# Altium project Reconfigurable_Test_Fixture.PrjPcb
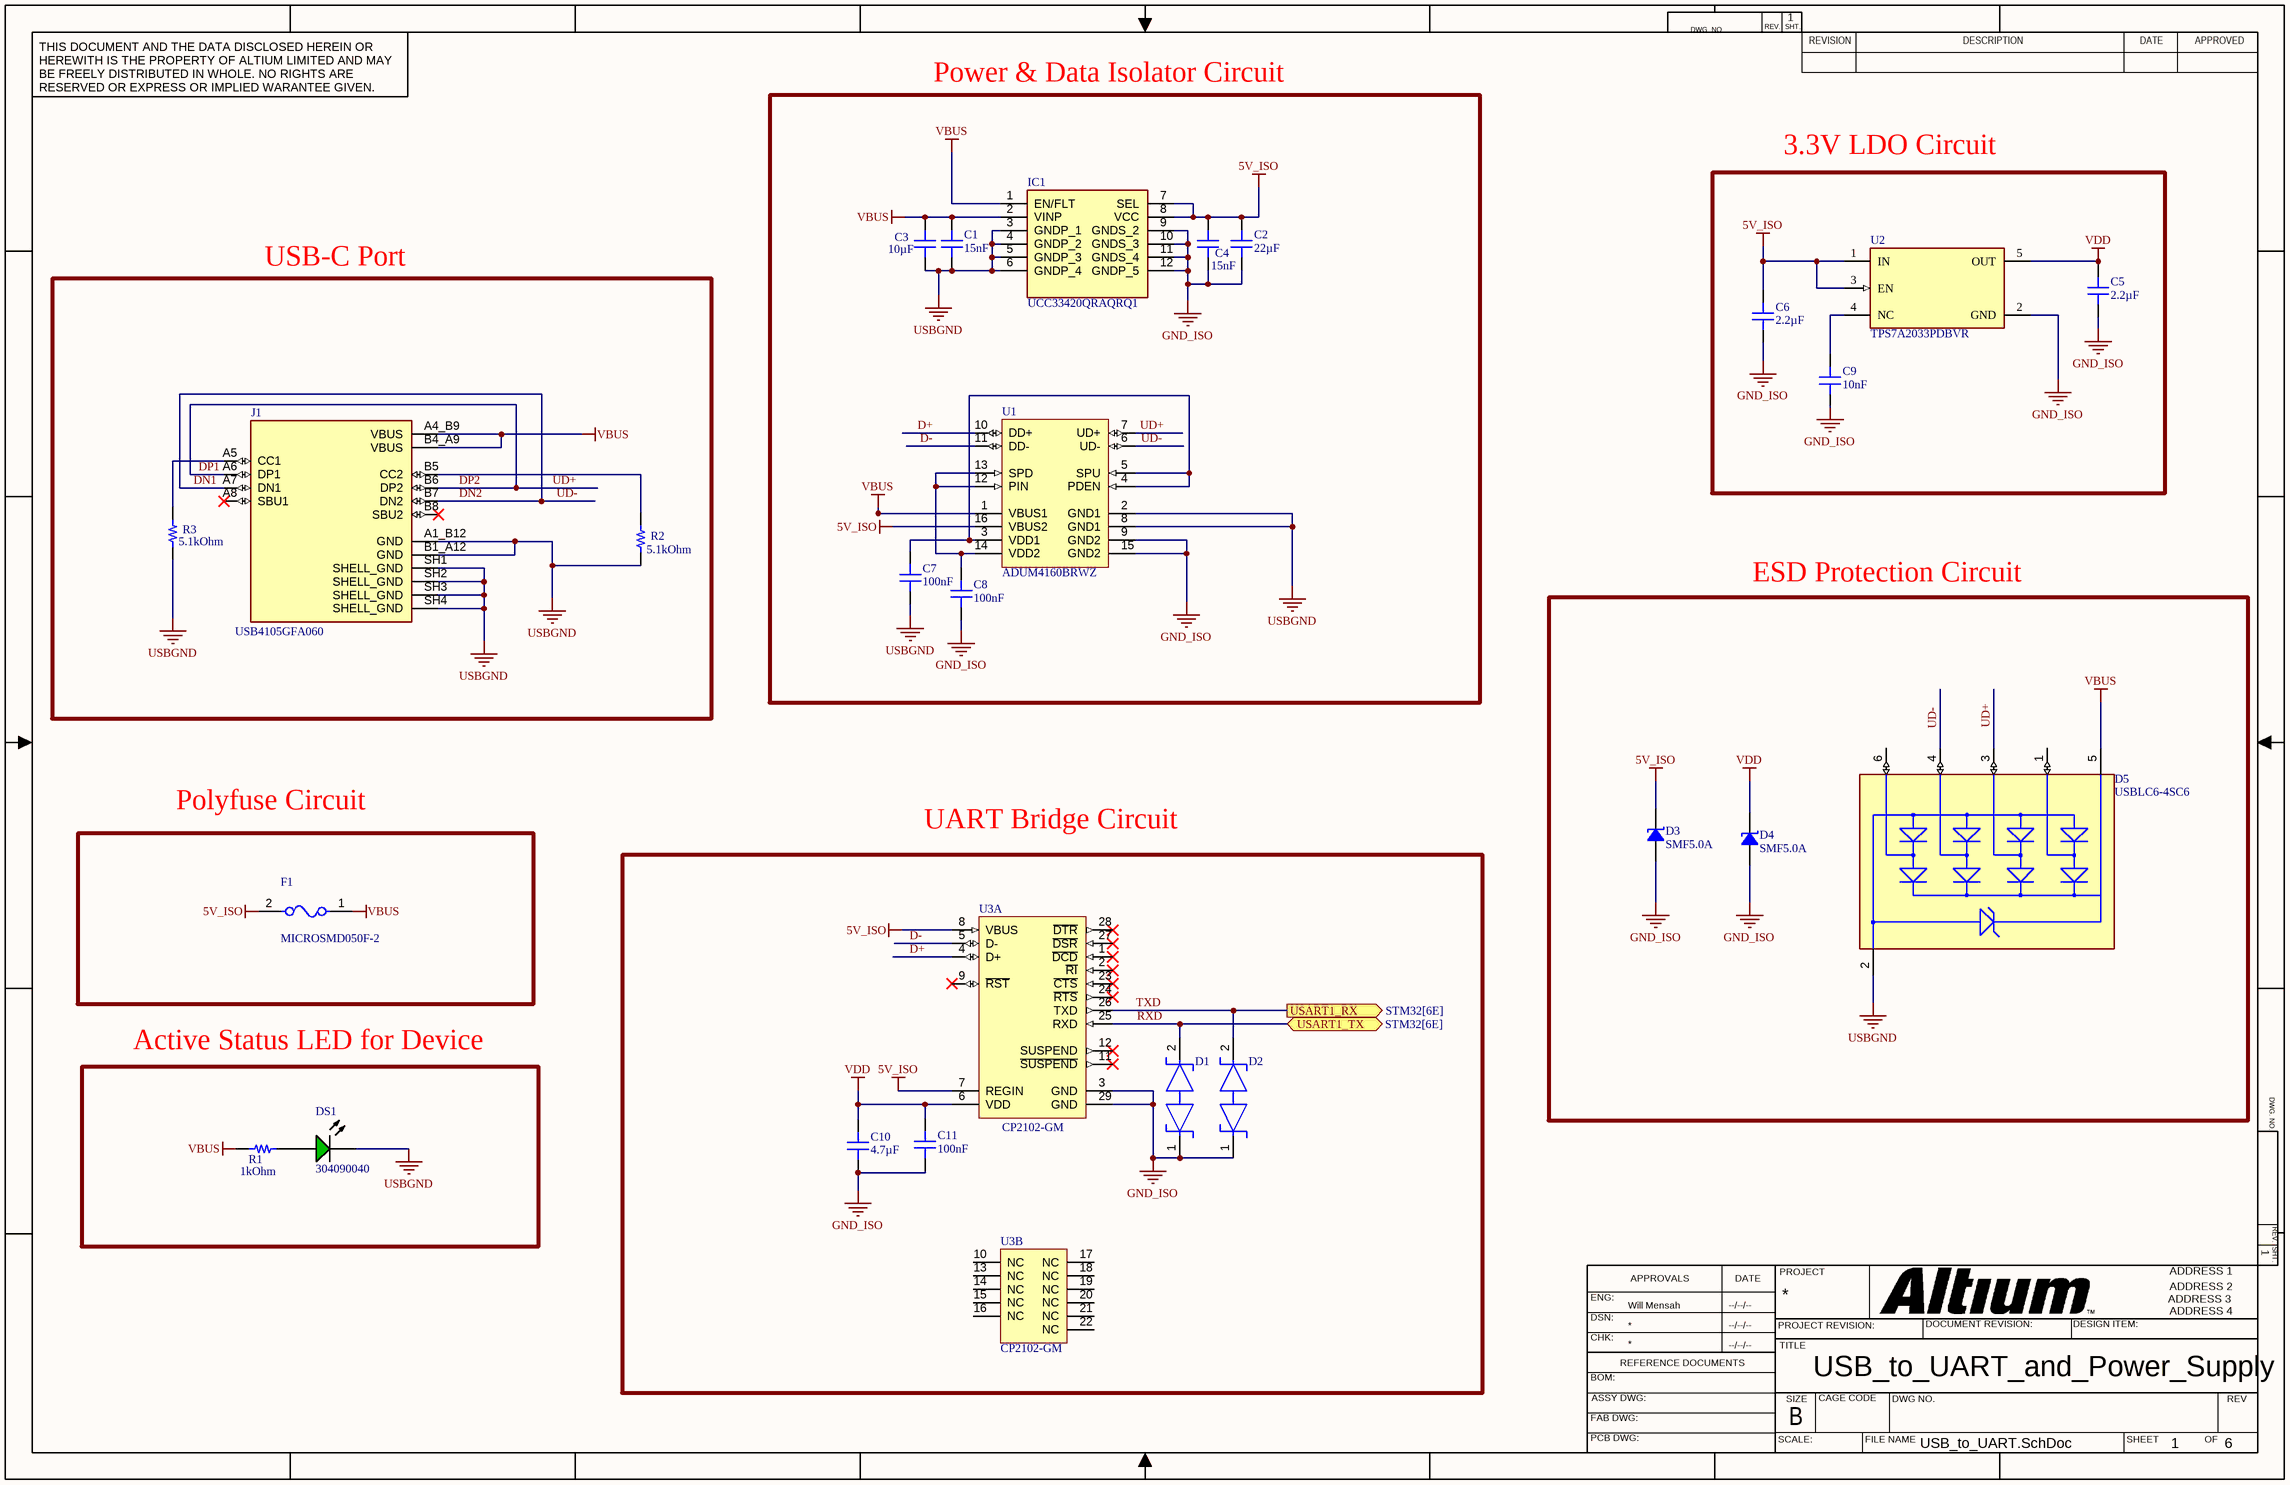
[diagram p0: USB_to_UART.SchDoc]
4 sheets, 81 parts. Net scope: flat (ports and power ports of the same name join across sheets).
Board file: PCB_1.PcbDoc
Sheets:
  USB_to_UART.SchDoc
  Muxes_and_ADC.SchDoc
  Voltage_Reference_Circuit.SchDoc
  ZIF_HIZ_and_Converter.SchDoc

## Sheet USB_to_UART.SchDoc: USB_to_UART_and_Power_Supply
size 431 x 279 mm; Engineer: Will Mensah; Organization: ORGANIZATION; Address1: ADDRESS 1; Address2: ADDRESS 2; Address3: ADDRESS 3; Address4: ADDRESS 4; Revision: -; SheetNumber: 1; SheetTotal: 6; ENG_APP_DATE: --/--/--; DSN_APP_DATE: --/--/--; CHK_APP_DATE: --/--/--

### Parts
C1  value 15nF  [CAP 1206_3216 - 0.8MM]  (hidden comment: 885342208013)
C2  value 22µF  [MURATA - GRM32E]  (hidden comment: GRM32ER71E226ME15L)
C3  value 10µF  [MURATA - GRM32E]  (hidden comment: GRM32ER71H106MA12L)
C4  value 15nF  [CAP 1206_3216 - 0.8MM]  (hidden comment: 885342208013)
C5  value 2.2µF  [MURATA CAP GCM31M 1206_3216]  (hidden comment: GCM31CL8EL225KE07L)
C6  value 2.2µF  [MURATA CAP GCM31M 1206_3216]  (hidden comment: GCM31CL8EL225KE07L)
C7  value 100nF  [MURATA CAP GCM31M 1206_3216]  (hidden comment: GCM31C5C1H104FA16L)
C8  value 100nF  [MURATA CAP GCM31M 1206_3216]  (hidden comment: GCM31C5C1H104FA16L)
C9  value 10nF  [MURATA CAP GRM31B 1206_3216]  (hidden comment: GRM31B7U2E103JW31L)
C10  value 4.7µF  [MURATA GRM21B 0805_2012]  (hidden comment: GRM21BR71A475KE51L)
C11  value 100nF  [MURATA CAP GCM31M 1206_3216]  (hidden comment: GCM31C5C1H104FA16L)
D1  TPD1E10B06DPYR  [FP-DPY0002A-MFG]  (value not drawn)
D2  TPD1E10B06DPYR  [FP-DPY0002A-MFG]  (value not drawn)
D3  SMF5.0A  [SOD123F]
D4  SMF5.0A  [SOD123F]
D5  USBLC6-4SC6  [FP-SOT23-6L-MFG]
DS1  304090040  [LED-2P-2.28-3MM]
F1  MICROSMD050F-2  [FP-microSMD-MFG]
IC1  UCC33420QRAQRQ1  [UCC33020QRAQRQ1]
J1  USB4105GFA060  [GCT_USB4105GFA060]
R1  1kOhm  [YAGEO RES 1206_3216]
R2  5.1kOhm  [YAGEO RES 1206_3216]
R3  5.1kOhm  [YAGEO RES 1206_3216]
U1  ADUM4160BRWZ  [RW-16_L]
U2  TPS7A2033PDBVR  [FP-DBV0005A-MFG]
U3  CP2102-GM  [SLAB-QFN-28-3125x3125TP_N]  (parts A,B of 2)

### Blocks framed on the sheet
Power & Data Isolator Circuit: C1-C4 C7 C8 IC1 U1
3.3V LDO Circuit: C5 C6 C9 U2
USB-C Port: J1 R2 R3
ESD Protection Circuit: D3-D5
Polyfuse Circuit: F1
UART Bridge Circuit: C10 C11 D1 D2 U3
Active Status LED for Device: DS1 R1

### Ports
USART1_RX (out, see STM32[6E]), USART1_TX (bidir, see STM32[6E])

### Nets
5V_ISO: C2.2 C4.2 C6.2 D3.2 F1.2 IC1.7(SEL) IC1.8(VCC) U1.16(VBUS2) U2.1(IN) U2.3(EN) U3.7(REGIN) U3.8(VBUS)
GND_ISO: C2.1 C4.1 C5.1 C6.1 C8.1 C9.1 C10.1 C11.1 D1.1 D2.1 D3.1 D4.1 IC1.9(GNDS_2) IC1.10(GNDS_3) IC1.11(GNDS_4) IC1.12(GNDP_5) U1.9(GND2) U1.15(GND2) U2.2(GND) U3.3(GND) U3.29(GND)
USBGND: C1.1 C3.1 C7.1 D5.2(GND) DS1.2(K) IC1.3(GNDP_1) IC1.4(GNDP_2) IC1.5(GNDP_3) IC1.6(GNDP_4) J1.A1_B12(GND) J1.B1_A12(GND) J1.SH1(SHELL_GND) J1.SH2(SHELL_GND) J1.SH3(SHELL_GND) J1.SH4(SHELL_GND) R2.1 R3.2 U1.2(GND1) U1.8(GND1)
VBUS: C1.2 C3.2 D5.5(VBUS) F1.1 IC1.1(EN/FLT) IC1.2(VINP) J1.A4_B9(VBUS) J1.B4_A9(VBUS) R1.2 U1.1(VBUS1)
VDD: C5.2 C10.2 C11.2 D4.2 U2.5(OUT) U3.6(VDD)
D+: U1.10(DD+) U3.4(D+)
D-: U1.11(DD-) U3.5(D-)
DN1: D5.4(I/O3) J1.A7(DN1) J1.B7(DN2) U1.6(UD-)  [also labelled DN2, UD-]
DP1: D5.3(I/O2) J1.A6(DP1) J1.B6(DP2) U1.7(UD+)  [also labelled DP2, UD+]
RXD: D1.2 U3.25(RXD) ; port USART1_TX
TXD: D2.2 U3.26(TXD) ; port USART1_RX
NetC7_2: C7.2 U1.3(VDD1) U1.4(PDEN) U1.5(SPU)
NetC8_2: C8.2 U1.12(PIN) U1.13(SPD) U1.14(VDD2)
NetC9_2: C9.2 U2.4(NC)
NetDS1_1: DS1.1(A) R1.1
NetJ1_A5: J1.A5(CC1) R3.1
NetJ1_B5: J1.B5(CC2) R2.2

Not connected (* = marked no-connect by the designer): D5 1(I/O1) 6(I/O4); J1 A8(SBU1)* B8(SBU2)*; U3 1(~{DCD})* 2(~{RI})* 9(~{RST})* 10(NC) 11(~{SUSPEND})* 12(SUSPEND)* 13(NC) 14(NC) 15(NC) 16(NC) 17(NC) 18(NC) 19(NC) 20(NC) 21(NC) 22(NC) 23(~{CTS})* 24(~{RTS})* 27(~{DSR})* 28(~{DTR})*

### Notes on the sheet
- DWG. NO.
- REV.
- SHT.
- THIS DOCUMENT AND THE DATA DISCLOSED HEREIN OR HEREWITH IS THE PROPERTY OF ALTIUM LIMITED AND MAY BE FREELY DISTRIBUTED IN WHOLE. NO RIGHTS ARE RESERVED OR EXPRESS OR IMPLIED WARANTEE GIVEN.
- REVISION
- DESCRIPTION
- DATE
- APPROVED
- ENG:
- APPROVALS
- PROJECT
- DSN:
- CHK:
- REFERENCE DOCUMENTS
- PROJECT REVISION:
- TITLE
- DOCUMENT REVISION:
- DESIGN ITEM:
- BOM:
- FAB DWG:
- PCB DWG:
- ASSY DWG:
- SCALE:
- SIZE
- B
- CAGE CODE
- FILE NAME
- DWG NO.
- SHEET
- OF
- REV

### Library data of the parts
C1 C4 = CMP-001-059796-1: CAP CER 15000PF 630V X7R 1206; Part Number: 885342208013
C2 = CMP-001-068110-1: CAP CER 22UF 25V X7R 1210; Part Number: GRM32ER71E226ME15L
C3 = CMP-001-068673-1: CAP CER 10UF 50V X7R 1210; Part Number: GRM32ER71H106MA12L
C5 C6 = CMP-001-063237-1: CAP CER 2.2UF 100V X8L 1206; Part Number: GCM31CL8EL225KE07L
C7 C8 C11 = CMP-001-060542-1: CAP CER 0.1UF 50V C0G/NP0 1206; Part Number: GCM31C5C1H104FA16L
C9 = CMP-001-062663-1: CAP CER 10000PF 250V U2J 1206; Part Number: GRM31B7U2E103JW31L
C10 = CMP-001-052117-1: CAP CER 4.7UF 10V X7R 0805; Part Number: GRM21BR71A475KE51L
D1 D2 = CMP-0326-00004-4: TVS DIODE 5.5V 14V 2X1SON; Manufacturer: Texas Instruments; Leakage Current: 100nA; Min Breakdown Voltage: 6V; Number of Channels: 1; ESD Protection: Yes; Power Line Protection: No; Test Current: 1mA; Interface: GPIO; Element Configuration: Single; Peak Pulse Current: 5A; Direction: Bidirectional; Peak Pulse Power: 90W; Capacitance: 12pF; Composition: Zener; Packaging: Tape and Reel; Number of Pins: 2; Breakdown Voltage: 6V; Radiation Hardening: No; Min Operating Temperature: -40°C; Contact Plating: Gold; Lead Free: Lead Free; Height: 0.35mm; REACH SVHC: No SVHC; Case/Package: 0402; Max Operating Temperature: 125°C; Width: 0.7mm; Clamping Voltage: 14V; Package Quantity: 1; Max Reverse Leakage Current: 100nA; Working Voltage: 5.5V; Length: 1.1mm; Number of Bidirectional Channels: 1; Reverse Standoff Voltage: 5.5V; PartNumber: TPD1E10B06DPYR
D3 D4 = CMP-004-19987-1: TVS SOD123FL 5V 200W UNIDIR; Part Number: SMF5.0A
D5 = CMP-2000-07370-2: TVS DIODE 5.25V 17V SOT23-6; Manufacturer: STMicroelectronics; Peak Pulse Power: 130W; Breakdown Voltage: 6V; Value: 3pF; Direction: Unidirectional; Interface: USB,Ethernet,Other; Number Of Channels: 4; Standoff Height: 0mm; Max Junction Temp: +125°C; Digikey Description: TVS DIODE 5.25V 17V SOT23-6; Automotive: No; Package: SOT23-6L; Mouser Description: USBLC6 Series 4 Line 6 V Uni / Bi-Directional ESD Protection - SOT-23-6; Octopart: https://octopart.com/usblc6-4sc6-stmicroelectronics-347147; RoHS: TRUE; ComponentLink2URL: https://upverter.com/datasheet/23dc4ffb028d868909e80577610284b194f13213.pdf; ComponentLink2Description: Datasheet; Device Class L1: Circuit Protection; Lead Free: Yes; Temperature Range High: +125°C; Device Class L2: ESD and Circuit Protection ICs; Device Class L3: unset; Capacitance: 3pF; Height: 1.45mm; Temperature Range Low: -40°C; Manufacturer Part Number: USBLC6-4SC6; Temperature: -40°C to +125°C; Category: Diode; Clamping Voltage: 17V
DS1 = CMP-007-00006-2: Green LED, 80 mW, 20 mA, -25 to 85 degC, 2-Pin THD; Manufacturer: Shenzhen CGX; Manufacturer URL: http://szcgx.com/; Package Reference: 304090040; Datasheet Version: Rev. 1.0, 09/2014; RoHS Compliant: Unknown; Case/Package: 304090040; Package Description: 2-Pin Through Hole Device, Dia 3 mm, Pitch 2.28 mm; Datasheet URL: http://datasheet.octopart.com/304090040-Chengguangxing-datasheet-62330655.pdf; Mounting Technology: TH
F1 = CMP-08606-000015-1: PTC RESET FUSE 13.2V 500MA 1210; Manufacturer: Littelfuse; Hold Current: 0.5A; Resistance: 0.25-0.9Ω; Trip Time: 0.05s; Value: 0.25-0.9Ω; Trip Current: 1A; Current Rating: 40A; Device Class L3: unset; ComponentLink2URL: https://www.littelfuse.com/~/media/electronics/datasheets/resettable_ptcs/littelfuse_ptc_microsmd_datasheet.pdf.pdf; Temperature: to +85°C; ComponentLink2Description: Datasheet; RoHS: TRUE; Category: Fuse; Ambient Temperature Range Low: -40°C; Lead Free: Yes; Device Class L1: Circuit Protection; Manufacturer Part Number: MICROSMD050F-2; Temperature Range High: +85°C; Ambient Temperature Range High: +85°C; Automotive: No; Height: 0.62mm; Digikey Description: PTC RESET FUSE 13.2V 500MA 1210; Voltage Rating: 13.2V; Package: microSMD; Octopart: https://octopart.com/microsmd050f-2-littelfuse-74214982; Device Class L2: PTC Resettable Fuses
IC1 = UCC33420QRAQRQ1: Integrated Circuit; Manufacturer_Name: Texas Instruments; Datasheet Link: https://www.ti.com/lit/ds/symlink/ucc33420-q1.pdf?ts=1741595347894&ref_url=https%253A%252F%252Fwww.ti.com%252Fproduct%252FUCC33420-Q1; Height: 1.05mm; Manufacturer_Part_Number: UCC33420QRAQRQ1; Mouser Part Number: 595-UCC33420QRAQRQ1; Mouser Price/Stock: https://www.mouser.co.uk/ProductDetail/Texas-Instruments/UCC33420QRAQRQ1?qs=7%2F6SraaimPSitAwgIt4uJA%3D%3D; Arrow Part Number: UCC33420QRAQRQ1; Arrow Price/Stock: https://www.arrow.com/en/products/ucc33420qraqrq1/texas-instruments?utm_currency=USD&region=nac
J1 = CMP-002-00267-1: USB-C (USB TYPE-C) USB 2.0 Receptacle Connector 24 (16+8 Dummy) Position Surface Mount, Right Angle; Through Hole; MF: Global Connector Technology; Check_prices: https://www.snapeda.com/parts/USB4105GFA060/Global+Connector+Technology/view-part/?ref=eda; Component Type: Standard; Source: USB4105GFA060.SchLib; SnapEDA_Link: https://www.snapeda.com/parts/USB4105GFA060/Global+Connector+Technology/view-part/?ref=snap; Pins: 16; Case/Package: None; Design Item ID: USB4105GFA060; Value: *; MP: USB4105GFA060
R1 = CMP-009-085524-1: RES 1K OHM 1% 1/4W 1206; Part Number: RC1206FR-101KL
R2 R3 = CMP-009-086345-1: RES 5.1K OHM 0.1% 1/4W 1206; Part Number: RP1206BRD075K1L
U1 = CMP-0534-00647-1: Full/Low Speed USB Digital Isolator, 2 Channels, 5 kV rms, 3.1 to 5.5 V, -40 to 105 degC, 16-Pin SOIC (RW-16), RoHS, Tube; Manufacturer: Analog Devices; IDD@12 Mbps: 8 mA Max.; Number of Channels: 2; Data Rate: 12 Mbps Max.; CIN: 10 pF Typ.; Voltage Isolation: 5 kVrms; DatasheetVersion: Rev. D; VBUS: 3.1 to 5.5 V; PartNumber: ADUM4160BRWZ; Temperature Range: -40 to 105 degC; Mounting Technology: Surface Mount; PackageDescription: 16-Pin Small Outline Integrated Circuit, Body 10.3 x 7.5 mm, Pitch 1.27 mm; ComponentLink2URL: http://www.analog.com/static/imported-files/data_sheets/ADuM4160.pdf; PackageVersion: Mar-07; ComponentLink2Description: Datasheet; ComponentLink1URL: http://www.analog.com/en/index.html; Packing: Tube; ComponentLink3URL: http://www.analog.com/static/imported-files/packages/PKG_PDF/SOIC_WIDE%20(RW)/RW_16.pdf; RoHS: TRUE; ComponentLink3Description: Package Specification; ComponentLink1Description: Manufacturer URL
U2 = CMP-04917-000300-1: IC REG LINEAR 3.3V 300MA SOT23-5; RoHS Compliant: Yes
U3 = CMP-0511-00012-1: Single-Chip USB to UART Bridge, 1024 Bytes EEPROM, -40 to 85 degC, 28-pin QFN, Tube; Manufacturer: Silicon Labs; Internal Oscillator: TRUE; Sub-Family: USB Bridges; ComponentLink3Description: Package Specification; PackageDescription: 28-Pin Quad-Flat No-Leads Package, Body 5 x 5 mm, Pitch 0.5 mm; PartNumber: CP2102-GM; EEPROM: 1024 Bytes; Mounting Technology: Surface Mount; ComponentLink2URL: http://www.silabs.com/Support%20Documents/TechnicalDocs/CP2102-9.pdf; DatasheetVersion: Rev. 1.5; ComponentLink1URL: http://www.silabs.com/; ComponentLink2Description: Datasheet; Code_JEDEC: MO-220; PackageReference: QFN-28; Code_IPC: J-STD-020C; ComponentLink3URL: http://www.silabs.com/Support%20Documents/TechnicalDocs/C8051T61x.pdf; ComponentLink1Description: Manufacturer URL

## Sheet Muxes_and_ADC.SchDoc: Multiplexers_and_ADC
size 431 x 279 mm; DrawnBy: Will Mensah; Organization: ORGANIZATION; Address1: ADDRESS 1; Address2: ADDRESS 2; Address3: ADDRESS 3; Address4: ADDRESS 4; Revision: -; SheetNumber: 4; SheetTotal: 6; ENG_APP_DATE: --/--/--; DSN_APP_DATE: --/--/--; CHK_APP_DATE: --/--/--
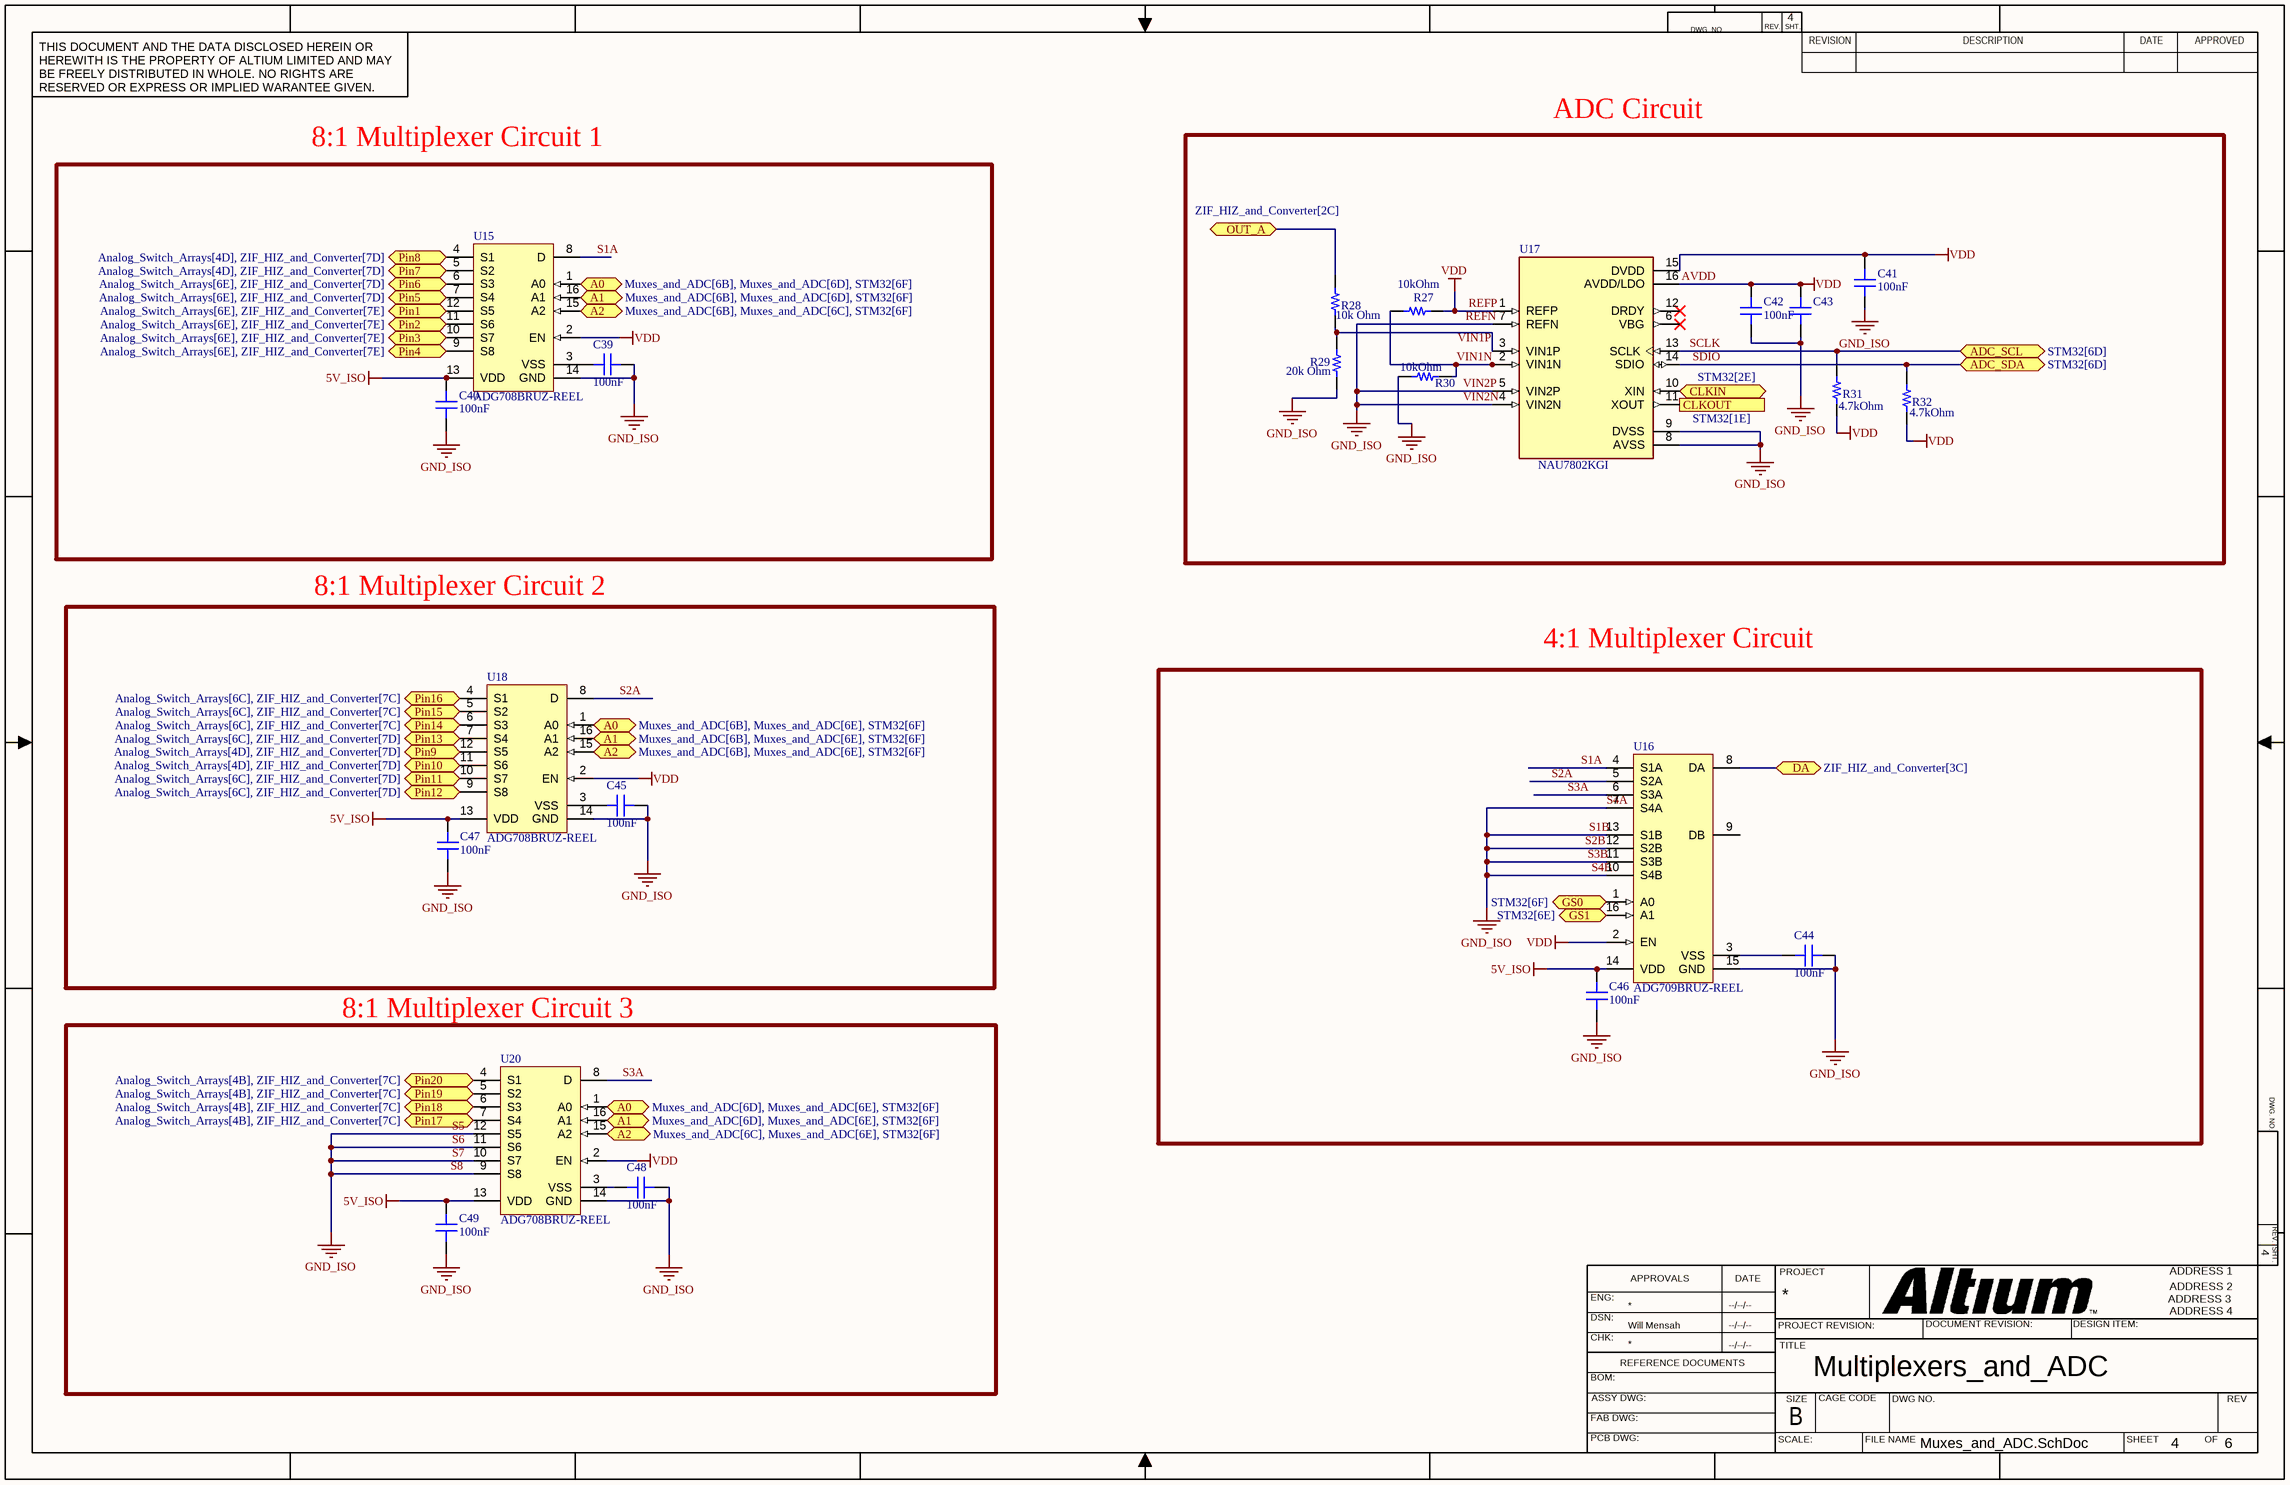
[diagram p1: Muxes_and_ADC.SchDoc]

### Parts
C39  value 100nF  [CAP 1206_3216 - 0.8MM]  (hidden comment: C1206X104G4HAC7800)
C40  value 100nF  [CAP 1206_3216 - 0.8MM]  (hidden comment: C1206X104G4HAC7800)
C41  value 100nF  [CAP 1206_3216 - 0.8MM]  (hidden comment: C1206X104G4HAC7800)
C42  value 100nF  [CAP 1206_3216 - 0.8MM]  (hidden comment: C1206X104G4HAC7800)
C43  C1206X104G4HAC7800  [CAP 1206_3216 - 0.8MM]  (value not drawn)
C44  value 100nF  [CAP 1206_3216 - 0.8MM]  (hidden comment: C1206X104G4HAC7800)
C45  value 100nF  [CAP 1206_3216 - 0.8MM]  (hidden comment: C1206X104G4HAC7800)
C46  value 100nF  [CAP 1206_3216 - 0.8MM]  (hidden comment: C1206X104G4HAC7800)
C47  value 100nF  [CAP 1206_3216 - 0.8MM]  (hidden comment: C1206X104G4HAC7800)
C48  value 100nF  [CAP 1206_3216 - 0.8MM]  (hidden comment: C1206X104G4HAC7800)
C49  value 100nF  [CAP 1206_3216 - 0.8MM]  (hidden comment: C1206X104G4HAC7800)
R27  10kOhm  [RES 1206_3216]
R28  10k Ohm  [RES 1206_3216]
R29  20k Ohm  [RES 1206_3216]
R30  10kOhm  [RES 1206_3216]
R31  4.7kOhm  [RES 1206_3216]
R32  4.7kOhm  [RES 1206_3216]
U15  ADG708BRUZ-REEL  [ADI-RU-16_N]
U16  ADG709BRUZ-REEL  [ADI-RU-16_M]
U17  NAU7802KGI  [DIP792W45P254L1904H533Q16]
U18  ADG708BRUZ-REEL  [ADI-RU-16_N]
U20  ADG708BRUZ-REEL  [ADI-RU-16_N]

### Blocks framed on the sheet
8:1 Multiplexer Circuit 1: C39 C40 U15
ADC Circuit: C41-C43 R27-R32 U17
8:1 Multiplexer Circuit 2: C45 C47 U18
4:1 Multiplexer Circuit: C44 C46 U16
8:1 Multiplexer Circuit 3: C48 C49 U20

### Ports
A0 (bidir, see Muxes_and_ADC[6B], Muxes_and_ADC[6D], STM32[6F]), A0 (bidir, see Muxes_and_ADC[6B], Muxes_and_ADC[6E], STM32[6F]), A0 (bidir, see Muxes_and_ADC[6D], Muxes_and_ADC[6E], STM32[6F]), A1 (bidir, see Muxes_and_ADC[6B], Muxes_and_ADC[6D], STM32[6F]), A1 (bidir, see Muxes_and_ADC[6B], Muxes_and_ADC[6E], STM32[6F]), A1 (bidir, see Muxes_and_ADC[6D], Muxes_and_ADC[6E], STM32[6F]), A2 (bidir, see Muxes_and_ADC[6B], Muxes_and_ADC[6C], STM32[6F]), A2 (bidir, see Muxes_and_ADC[6B], Muxes_and_ADC[6E], STM32[6F]), A2 (bidir, see Muxes_and_ADC[6C], Muxes_and_ADC[6E], STM32[6F]), ADC_SCL (bidir, see STM32[6D]), ADC_SDA (bidir, see STM32[6D]), CLKIN (bidir, see STM32[2E]), CLKOUT (out, see STM32[1E]), DA (bidir, see ZIF_HIZ_and_Converter[3C]), GS0 (bidir, see STM32[6F]), GS1 (bidir, see STM32[6E]), OUT_A (bidir, see ZIF_HIZ_and_Converter[2C]), Pin1 (bidir, see Analog_Switch_Arrays[6E], ZIF_HIZ_and_Converter[7E]), Pin2 (bidir, see Analog_Switch_Arrays[6E], ZIF_HIZ_and_Converter[7E]), Pin3 (bidir, see Analog_Switch_Arrays[6E], ZIF_HIZ_and_Converter[7E]), Pin4 (bidir, see Analog_Switch_Arrays[6E], ZIF_HIZ_and_Converter[7E]), Pin5 (bidir, see Analog_Switch_Arrays[6E], ZIF_HIZ_and_Converter[7D]), Pin6 (bidir, see Analog_Switch_Arrays[6E], ZIF_HIZ_and_Converter[7D]), Pin7 (bidir, see Analog_Switch_Arrays[4D], ZIF_HIZ_and_Converter[7D]), Pin8 (bidir, see Analog_Switch_Arrays[4D], ZIF_HIZ_and_Converter[7D]), Pin9 (bidir, see Analog_Switch_Arrays[4D], ZIF_HIZ_and_Converter[7D]), Pin10 (bidir, see Analog_Switch_Arrays[4D], ZIF_HIZ_and_Converter[7D]), Pin11 (bidir, see Analog_Switch_Arrays[6C], ZIF_HIZ_and_Converter[7D]), Pin12 (bidir, see Analog_Switch_Arrays[6C], ZIF_HIZ_and_Converter[7D]), Pin13 (bidir, see Analog_Switch_Arrays[6C], ZIF_HIZ_and_Converter[7D]), Pin14 (bidir, see Analog_Switch_Arrays[6C], ZIF_HIZ_and_Converter[7C]), Pin15 (bidir, see Analog_Switch_Arrays[6C], ZIF_HIZ_and_Converter[7C]), Pin16 (bidir, see Analog_Switch_Arrays[6C], ZIF_HIZ_and_Converter[7C]), Pin17 (bidir, see Analog_Switch_Arrays[4B], ZIF_HIZ_and_Converter[7C]), Pin18 (bidir, see Analog_Switch_Arrays[4B], ZIF_HIZ_and_Converter[7C]), Pin19 (bidir, see Analog_Switch_Arrays[4B], ZIF_HIZ_and_Converter[7C]), Pin20 (bidir, see Analog_Switch_Arrays[4B], ZIF_HIZ_and_Converter[7C])

### Nets
5V_ISO: C40.2 C46.1 C47.1 C49.1 U15.13(VDD) U16.14(VDD) U18.13(VDD) U20.13(VDD)
GND_ISO: C39.1 C40.1 C41.2 C42.2 C43.2 C44.1 C45.1 C46.2 C47.2 C48.1 C49.2 R29.1 R30.2 U15.14(GND) U16.7(S4A) U16.10(S4B) U16.11(S3B) U16.12(S2B) U16.13(S1B) U16.15(GND) U17.4(VIN2N) U17.5(VIN2P) U17.7(REFN) U17.8(AVSS) U17.9(DVSS) U18.14(GND) U20.9(S8) U20.10(S7) U20.11(S6) U20.12(S5) U20.14(GND)  [also labelled REFN, S1B, S2B, S3B, S4A, S4B, S5, S6, S7, S8, VIN2N, VIN2P]
VDD: C41.1 C42.1 C43.1 R27.1 R31.1 R32.1 U15.2(EN) U16.2(EN) U17.1(REFP) U17.15(DVDD) U17.16(AVDD/LDO) U18.2(EN) U20.2(EN)  [also labelled AVDD, REFP]
S1A: U15.8(D) U16.4(S1A)
S2A: U16.5(S2A) U18.8(D)
S3A: U16.6(S3A) U20.8(D)
SCLK: R31.2 U17.13(SCLK) ; port ADC_SCL
SDIO: R32.2 U17.14(SDIO) ; port ADC_SDA
VIN1N: R27.2 R30.1 U17.2(VIN1N)
NetC39_2: C39.2 U15.3(VSS)
NetC44_2: C44.2 U16.3(VSS)
NetC45_2: C45.2 U18.3(VSS)
NetC48_2: C48.2 U20.3(VSS)
NetJ3_1: U15.12(S5) ; port Pin1
NetJ3_2: U15.11(S6) ; port Pin2
NetJ3_3: U15.10(S7) ; port Pin3
NetJ3_4: U15.9(S8) ; port Pin4
NetJ3_5: U15.7(S4) ; port Pin5
NetJ3_6: U15.6(S3) ; port Pin6
NetJ3_7: U15.5(S2) ; port Pin7
NetJ3_8: U15.4(S1) ; port Pin8
NetJ3_9: U18.12(S5) ; port Pin9
NetJ3_10: U18.11(S6) ; port Pin10
NetJ3_11: U18.10(S7) ; port Pin11
NetJ3_12: U18.9(S8) ; port Pin12
NetJ3_13: U18.7(S4) ; port Pin13
NetJ3_14: U18.6(S3) ; port Pin14
NetJ3_15: U18.5(S2) ; port Pin15
NetJ3_16: U18.4(S1) ; port Pin16
NetJ3_17: U20.7(S4) ; port Pin17
NetJ3_18: U20.6(S3) ; port Pin18
NetJ3_19: U20.5(S2) ; port Pin19
NetJ3_20: U20.4(S1) ; port Pin20
NetR28_1: R28.1 R29.2 U17.3(VIN1P)
NetR28_2: R28.2 ; port OUT_A
NetR33_2: U16.8(DA) ; port DA
NetU15_1: U15.1(A0) U18.1(A0) U20.1(A0) ; port A0
NetU15_15: U15.15(A2) U18.15(A2) U20.15(A2) ; port A2
NetU15_16: U15.16(A1) U18.16(A1) U20.16(A1) ; port A1
NetU16_1: U16.1(A0) ; port GS0
NetU16_16: U16.16(A1) ; port GS1
NetU17_10: U17.10(XIN) ; port CLKIN
NetU17_11: U17.11(XOUT) ; port CLKOUT

Not connected (* = marked no-connect by the designer): U16 9(DB); U17 6(VBG)* 12(DRDY)*

### Notes on the sheet
- Labels drawn without touching a wire or pin: VIN1P
- DWG. NO.
- REV.
- SHT.
- THIS DOCUMENT AND THE DATA DISCLOSED HEREIN OR HEREWITH IS THE PROPERTY OF ALTIUM LIMITED AND MAY BE FREELY DISTRIBUTED IN WHOLE. NO RIGHTS ARE RESERVED OR EXPRESS OR IMPLIED WARANTEE GIVEN.
- REVISION
- DESCRIPTION
- DATE
- APPROVED
- ENG:
- APPROVALS
- PROJECT
- DSN:
- CHK:
- REFERENCE DOCUMENTS
- PROJECT REVISION:
- TITLE
- DOCUMENT REVISION:
- DESIGN ITEM:
- BOM:
- FAB DWG:
- PCB DWG:
- ASSY DWG:
- SCALE:
- SIZE
- B
- CAGE CODE
- FILE NAME
- DWG NO.
- SHEET
- OF
- REV

### Library data of the parts
C39-C49 = CMP-001-063573-1: CAP CER 1206 0.1F 16V ULTRA STAB; Part Number: C1206X104G4HAC7800
R27 R28 R30 = CMP-009-078908-1: RES 10K OHM 0.1% 1/4W 1206; Part Number: TNPW120610K0BETY
R29 = CMP-009-083572-1: RES 20K OHM 0.1% 1/4W 1206; Part Number: TNPW120620K0BYEN
R31 R32 = CMP-009-078373-1: RES 4.7K OHM 0.1% 1/4W 1206; Part Number: TNPW12064K70BEEA
U15 U18 U20 = CMP-0798-00195-1: 1.8 to 5.5 V / +/-2.5 V, CMOS Low Voltage 3 Ohm, 8-Channel Multiplexer, -40 to 125 degC, 16-pin SOP (RU-16), Reel; Manufacturer: Analog Devices; t transition (s): 14n; Bandwidth (Hz): 55M; Supply V Guar Performance: Dual_(+/-2.5V), Single_(+3V), Single_(+5V); Ron (ohms): 3; Max Analog Signal Range: Vss to Vdd; ComponentLink1URL: http://www.analog.com/en/index.html; ComponentLink3Description: Package Specification; Code_JEDEC: MO-153AB; ComponentLink2URL: http://www.analog.com/static/imported-files/data_sheets/ADG708_709.pdf; Packing: Reel; ComponentLink3URL: http:/www.analog.com/static/imported-files/packages/36244347913743854010197452789RU16.pdf; PackageVersion: Nov-02; ComponentLink2Description: Datasheet; ComponentLink1Description: Manufacturer URL; PackageReference: RU-16; DatasheetVersion: Rev. C; PackageDescription: 16-Pin Thin Shrink Small Outline Package, Body 5 x 4.4 mm, Pitch 0.65 mm; PartNumber: ADG708BRUZ-REEL; Mounting Technology: Surface Mount
U16 = CMP-0798-00149-1: 1.8 to 5.5 V / +/-2.5 V, CMOS Low Voltage 3 Ohm, 4-Channel Multiplexer, -40 to 125 degC, 16-pin SOP (RU-16), Reel; Manufacturer: Analog Devices; Ron (ohms): 3; Supply V Guar Performance: Dual_(+/-2.5V), Single_(+3V), Single_(+5V); t transition (s): 14n; Max Analog Signal Range: Vss to Vdd; Bandwidth (Hz): 55M; Mounting Technology: Surface Mount; ComponentLink3URL: http:/www.analog.com/static/imported-files/packages/36244347913743854010197452789RU16.pdf; ComponentLink1Description: Manufacturer URL; PackageVersion: Nov-02; PackageDescription: 16-Pin Thin Shrink Small Outline Package, Body 5 x 4.4 mm, Pitch 0.65 mm; PartNumber: ADG709BRUZ-REEL; ComponentLink3Description: Package Specification; DatasheetVersion: Rev. C; ComponentLink2URL: http://www.analog.com/static/imported-files/data_sheets/ADG708_709.pdf; Code_JEDEC: MO-153AB; ComponentLink2Description: Datasheet; ComponentLink1URL: http://www.analog.com/en/index.html; PackageReference: RU-16; Packing: Reel
U17 = CMP-00256-1: 24 Bit Analog to Digital Converter 2 Input 1 Sigma-Delta 16-PDIP; MF: Nuvoton Technology Corporation of America; Component Type: Standard; Source: NAU7802KGI.SchLib; Design Item ID: NAU7802KGI; Package: Package; SnapEDA_Link: https://www.snapeda.com/parts/NAU7802KGI/Nuvoton/view-part/?ref=snap; Check_prices: https://www.snapeda.com/parts/NAU7802KGI/Nuvoton/view-part/?ref=eda; Value: *; MP: NAU7802KGI; Pin Count: 16

## Sheet Voltage_Reference_Circuit.SchDoc
size 431 x 279 mm; Organization: ORGANIZATION; Address1: ADDRESS 1; Address2: ADDRESS 2; Address3: ADDRESS 3; Address4: ADDRESS 4; Revision: -; SheetNumber: 5; SheetTotal: 6; ENG_APP_DATE: --/--/--; DSN_APP_DATE: --/--/--; CHK_APP_DATE: --/--/--
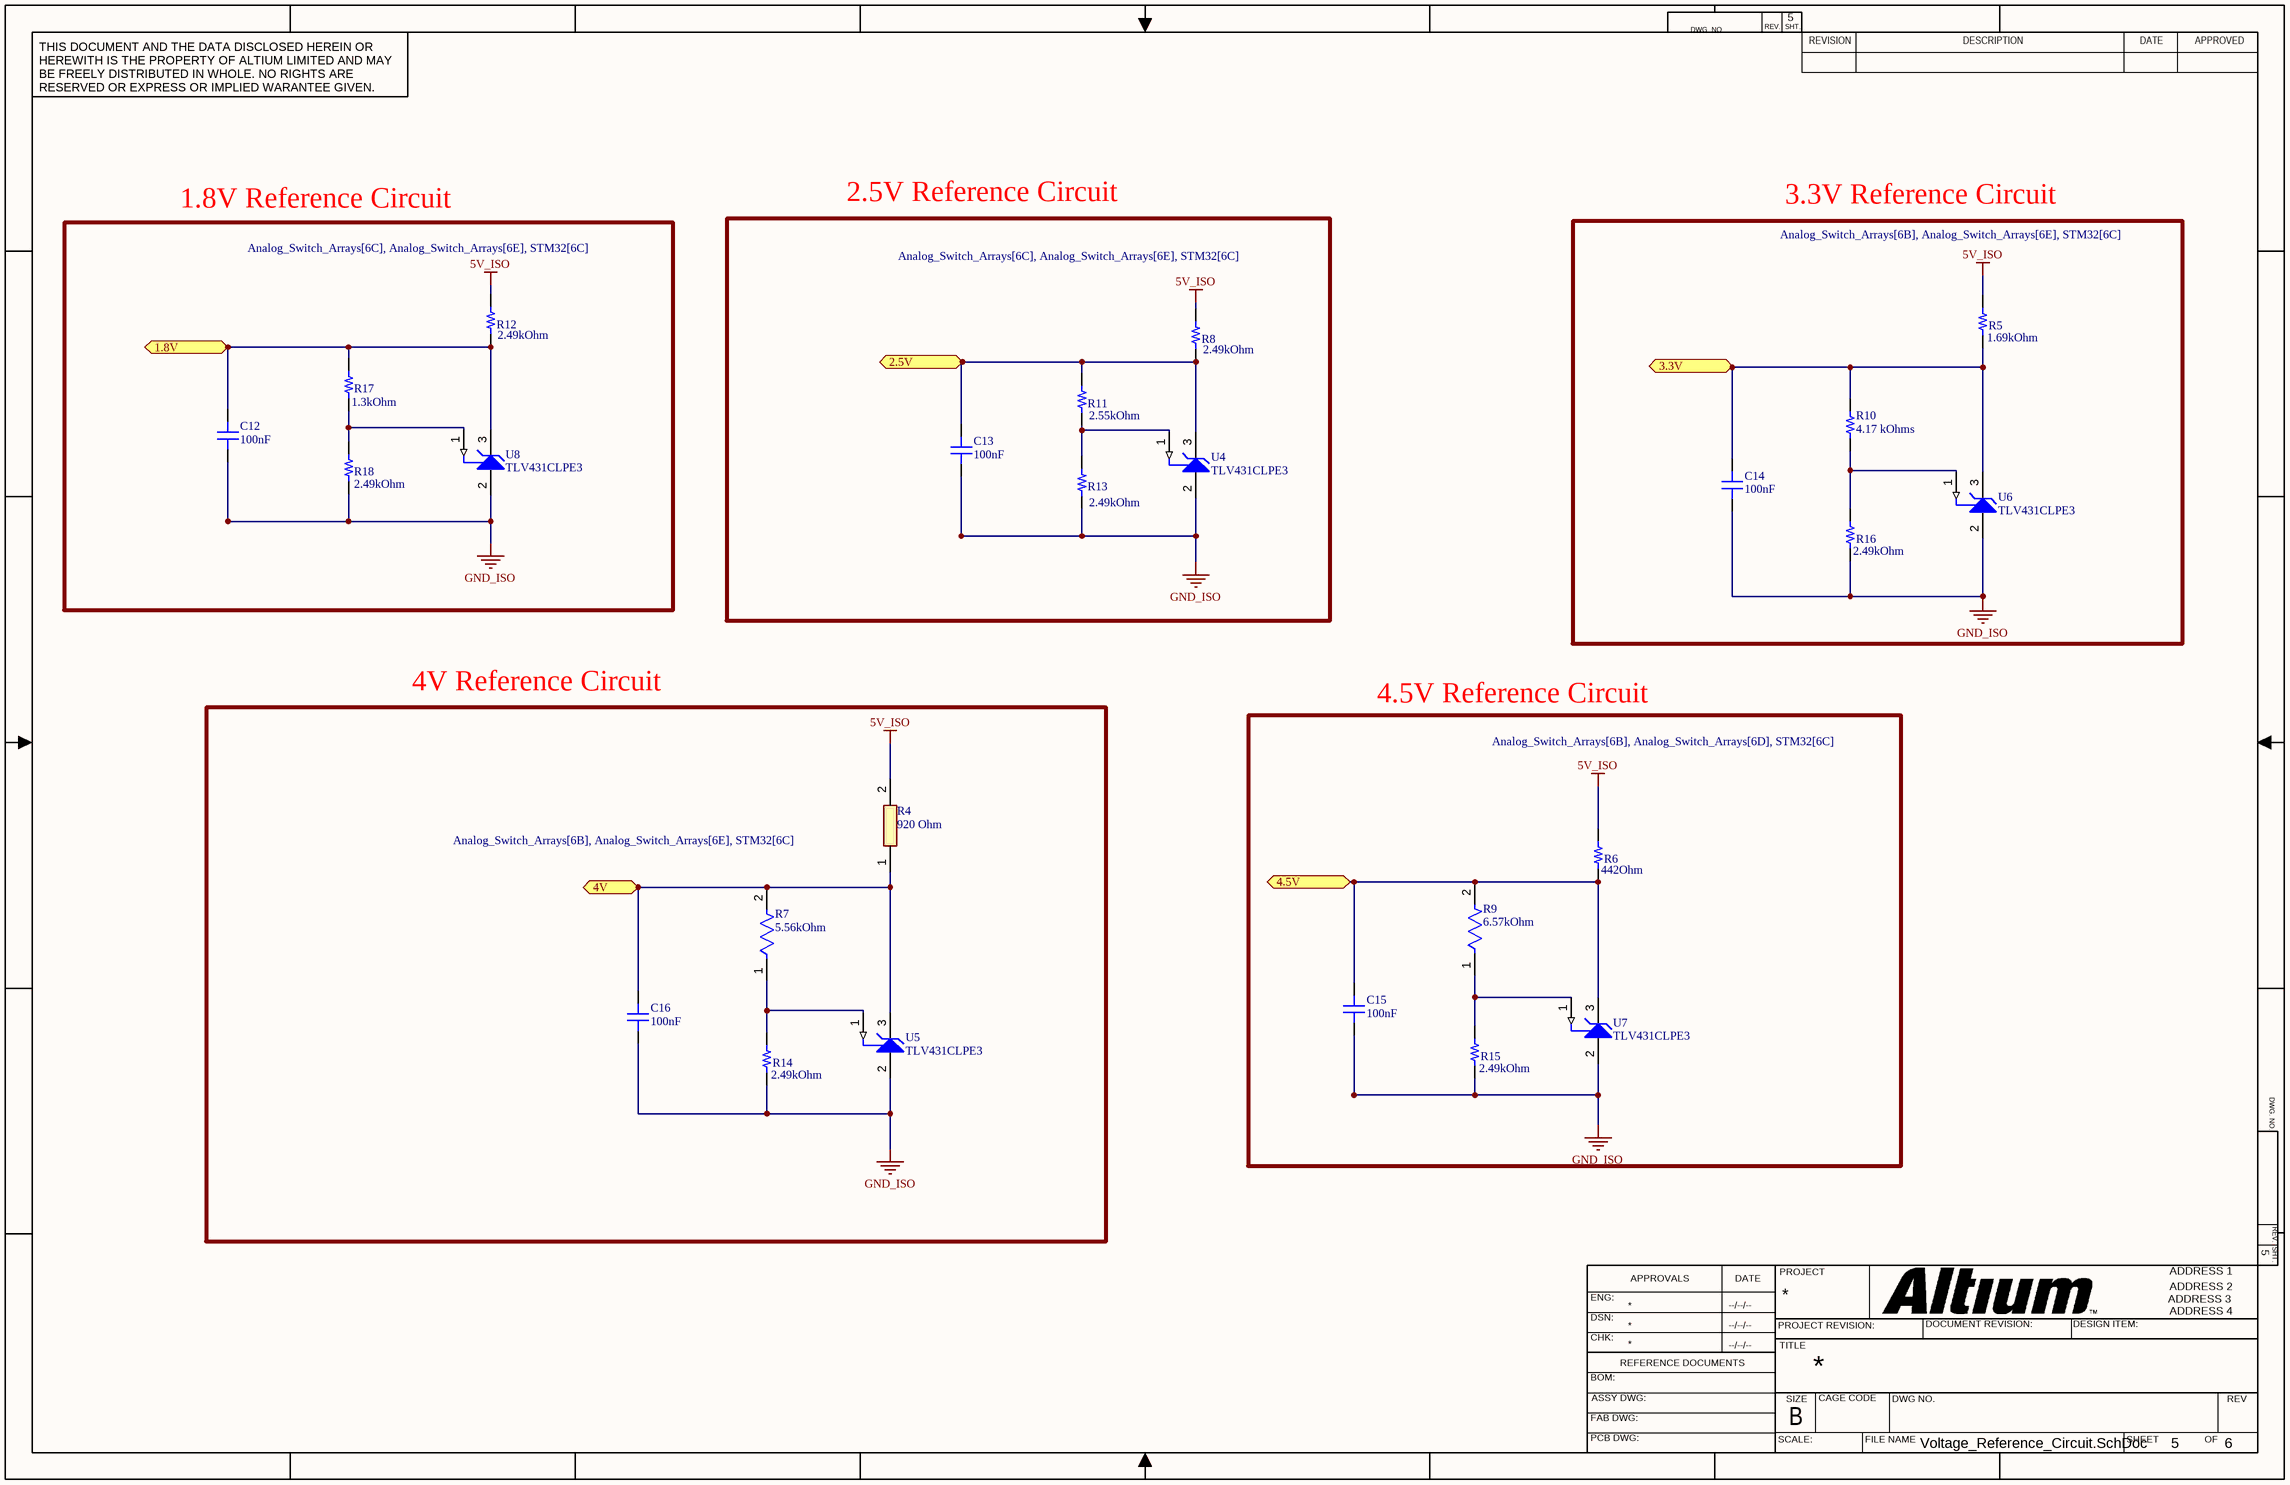
[diagram p2: Voltage_Reference_Circuit.SchDoc]

### Parts
C12  value 100nF  [CAP 1206_3216 - 0.8MM]  (hidden comment: VJ1206Y104KXXAC)
C13  value 100nF  [CAP 1206_3216 - 0.8MM]  (hidden comment: VJ1206Y104KXXAC)
C14  value 100nF  [CAP 1206_3216 - 0.8MM]  (hidden comment: VJ1206Y104KXXAC)
C15  value 100nF  [CAP 1206_3216 - 0.8MM]  (hidden comment: VJ1206Y104KXXAC)
C16  value 100nF  [CAP 1206_3216 - 0.8MM]  (hidden comment: VJ1206Y104KXXAC)
R4  920 Ohm  [RESC1608X55N]
R5  1.69kOhm  [RES 1206_3216]
R6  442Ohm  [YAGEO RES 1206_3216]
R7  5.56kOhm  [FP-RN73R2A-IPC_C]
R8  2.49kOhm  [RES 1206_3216]
R9  6.57kOhm  [FP-CRCW1206-e3-IPC_B]
R10  value 4.17 kOhms  [KOA RES RK73 RN73 0603_1608]  (hidden comment: RN73R1JTTD4171B25)
R11  2.55kOhm  [YAGEO RES 1206_3216]
R12  2.49kOhm  [RES 1206_3216]
R13  2.49kOhm  [RES 1206_3216]
R14  2.49kOhm  [RES 1206_3216]
R15  2.49kOhm  [RES 1206_3216]
R16  2.49kOhm  [RES 1206_3216]
R17  1.3kOhm  [RES 1206_3216]
R18  2.49kOhm  [RES 1206_3216]
U4  TLV431CLPE3  [TI-LP3]
U5  TLV431CLPE3  [TI-LP3]
U6  TLV431CLPE3  [TI-LP3]
U7  TLV431CLPE3  [TI-LP3]
U8  TLV431CLPE3  [TI-LP3]

### Blocks framed on the sheet
2.5V Reference Circuit: C13 R8 R11 R13 U4
1.8V Reference Circuit: C12 R12 R17 R18 U8
3.3V Reference Circuit: C14 R5 R10 R16 U6
4V Reference Circuit: C16 R4 R7 R14 U5
4.5V Reference Circuit: C15 R6 R9 R15 U7

### Ports
1.8V (bidir, see Analog_Switch_Arrays[6C], Analog_Switch_Arrays[6E], STM32[6C]), 2.5V (bidir, see Analog_Switch_Arrays[6C], Analog_Switch_Arrays[6E], STM32[6C]), 3.3V (bidir, see Analog_Switch_Arrays[6B], Analog_Switch_Arrays[6E], STM32[6C]), 4.5V (bidir, see Analog_Switch_Arrays[6B], Analog_Switch_Arrays[6D], STM32[6C]), 4V (bidir, see Analog_Switch_Arrays[6B], Analog_Switch_Arrays[6E], STM32[6C])

### Nets
5V_ISO: R4.2 R5.2 R6.2 R8.2 R12.2
GND_ISO: C12.1 C13.1 C14.1 C15.1 C16.1 R13.1 R14.1 R15.1 R16.1 R18.1 U4.2(ANODE) U5.2(ANODE) U6.2(ANODE) U7.2(ANODE) U8.2(ANODE)
NetC12_2: C12.2 R12.1 R17.2 U8.3(CATHODE) ; port 1.8V
NetC13_2: C13.2 R8.1 R11.2 U4.3(CATHODE) ; port 2.5V
NetC14_2: C14.2 R5.1 R10.2 U6.3(CATHODE) ; port 3.3V
NetC15_2: C15.2 R6.1 R9.2 U7.3(CATHODE) ; port 4.5V
NetC16_2: C16.2 R4.1 R7.2 U5.3(CATHODE) ; port 4V
NetR7_1: R7.1 R14.2 U5.1(REF)
NetR9_1: R9.1 R15.2 U7.1(REF)
NetR10_1: R10.1 R16.2 U6.1(REF)
NetR11_1: R11.1 R13.2 U4.1(REF)
NetR17_1: R17.1 R18.2 U8.1(REF)

### Notes on the sheet
- DWG. NO.
- REV.
- SHT.
- THIS DOCUMENT AND THE DATA DISCLOSED HEREIN OR HEREWITH IS THE PROPERTY OF ALTIUM LIMITED AND MAY BE FREELY DISTRIBUTED IN WHOLE. NO RIGHTS ARE RESERVED OR EXPRESS OR IMPLIED WARANTEE GIVEN.
- REVISION
- DESCRIPTION
- DATE
- APPROVED
- ENG:
- APPROVALS
- PROJECT
- DSN:
- CHK:
- REFERENCE DOCUMENTS
- PROJECT REVISION:
- TITLE
- DOCUMENT REVISION:
- DESIGN ITEM:
- BOM:
- FAB DWG:
- PCB DWG:
- ASSY DWG:
- SCALE:
- SIZE
- B
- CAGE CODE
- FILE NAME
- DWG NO.
- SHEET
- OF
- REV

### Library data of the parts
C12-C16 = CMP-001-062189-1: CAP CER 0.1UF 25V X7R 1206; Part Number: VJ1206Y104KXXAC
R4 = UPTF0603-16W-N-1781FT: Resistor; Manufacturer_Name: Venkel; Datasheet Link: https://page.venkel.com/hubfs/Resources/Datasheets/UPTF-Series.pdf; Height: 0.55mm; Manufacturer_Part_Number: UPTF0603-16W-N-1781FT
R5 = CMP-009-075815-1: RES 1.69 KOHMS 0.1% 0.4W 1206; Part Number: RQ73C2B1K69BTD
R6 = CMP-009-090039-1: RES SMD 442 OHM 0.1% 1/4W 1206; Part Number: RT1206BRD07442RL
R7 = CMP-04015-006256-1: 5.56kΩ ±0.1% 0.125W, 1/8W Chip Resistor 0805 (2012 Metric) Moisture Resistant Thin Film
R8 R12-R16 R18 = CMP-009-080149-1: RES SMD 2.49K OHM 1% 1/4W 1206; Part Number: KTR18EZPF2491
R9 = CMP-2003-02290-2: RES Thick Film, 6.57kΩ, 1%, 0.25W, 100ppm/°C, 1206; Resistance: 57.6kR; Power Rating: 250mW; Voltage Rating: 200V; Number of Pins: 2; Case/Package: 1206; Max Operating Temperature: 155°C; Min Operating Temperature: -55°C; Case Code (Imperial): 1206; Case Code (Metric): 3216; Temperature Coefficient: 100ppm/°C; Features: Automotive AEC-Q200; Packaging: Tape and Reel; Number of Terminations: 2; Military Standard: Not; Length: 3.2mm; Weight: 0.000353oz; Height: 0.55mm; Width: 0.063inch; Height - Seated (Max): 0.024inch; Voltage Rating (DC): 200V; Radiation Hardening: No; Composition: Thick Film; Package Quantity: 5000; Contact Plating: Tin; Tolerance: 1%; Lead Free: Lead Free; Max Power Dissipation: 250mW; Depth: 1.6mm
R10 = CMP-009-044138-1: RES 4.17K OHM 0.1% 1/10W 0603; Part Number: RN73R1JTTD4171B25
R11 = CMP-009-083477-1: RES SMD 2.55K OHM 0.1% 1/4W 1206; Part Number: RT1206BRD072K55L
R17 = CMP-009-082226-1: RES 1.13K OHM 1% 1/4W 1206; Part Number: RK73H2BTTD1131F
U4-U8 = CMP-0366-00210-1: Low Voltage Adjustable Precision Shunt Regulator, 39 ppm / degC, 15 mA, 0 to 70 degC, 3-pin TO-92 (LP), Pb-Free (RoHS); Manufacturer: Texas Instruments; Eco-Plan: Green (RoHS & no Sb/Br); Iout/Iz(Max)(mA): 15; VO Adj(Max)(V): 6; Min Iz for Regulation(uA): 80; SubFamily: Shunt Voltage Reference; VO Adj(Min)(V): 1.24; Rating: Catalog; Temp Coeff(Typ)(ppm/ degree C): 39; Initial Accuracy @ 25/deg C(%): 1.5; Temp Coeff(Max)(ppm/ degree C): 129; PackageReference: LP3; PackageDescription: Plastic Cylindrical Package, Formed Lead Option (TO-92); ComponentLink2URL: http://www.ti.com/general/docs/lit/getliterature.tsp?genericPartNumber=TLV431&fileType=pdf; ComponentLink2Description: Datasheet; ComponentLink3Description: Package Specification; ComponentLink1URL: http://www.ti.com/; PartNumber: TLV431CLPE3; PackageVersion: 4040001-2/C; Code_JEDEC: TO-226; ComponentLink3URL: http://www.ti.com/litv/pdf/msot002a; DatasheetVersion: SLVS139T; ComponentLink1Description: Manufacturer URL; Mounting Technology: Through Hole

## Sheet ZIF_HIZ_and_Converter.SchDoc
size 431 x 279 mm; Organization: ORGANIZATION; Address1: ADDRESS 1; Address2: ADDRESS 2; Address3: ADDRESS 3; Address4: ADDRESS 4; Revision: -; SheetNumber: 6; SheetTotal: 6; ENG_APP_DATE: --/--/--; DSN_APP_DATE: --/--/--; CHK_APP_DATE: --/--/--
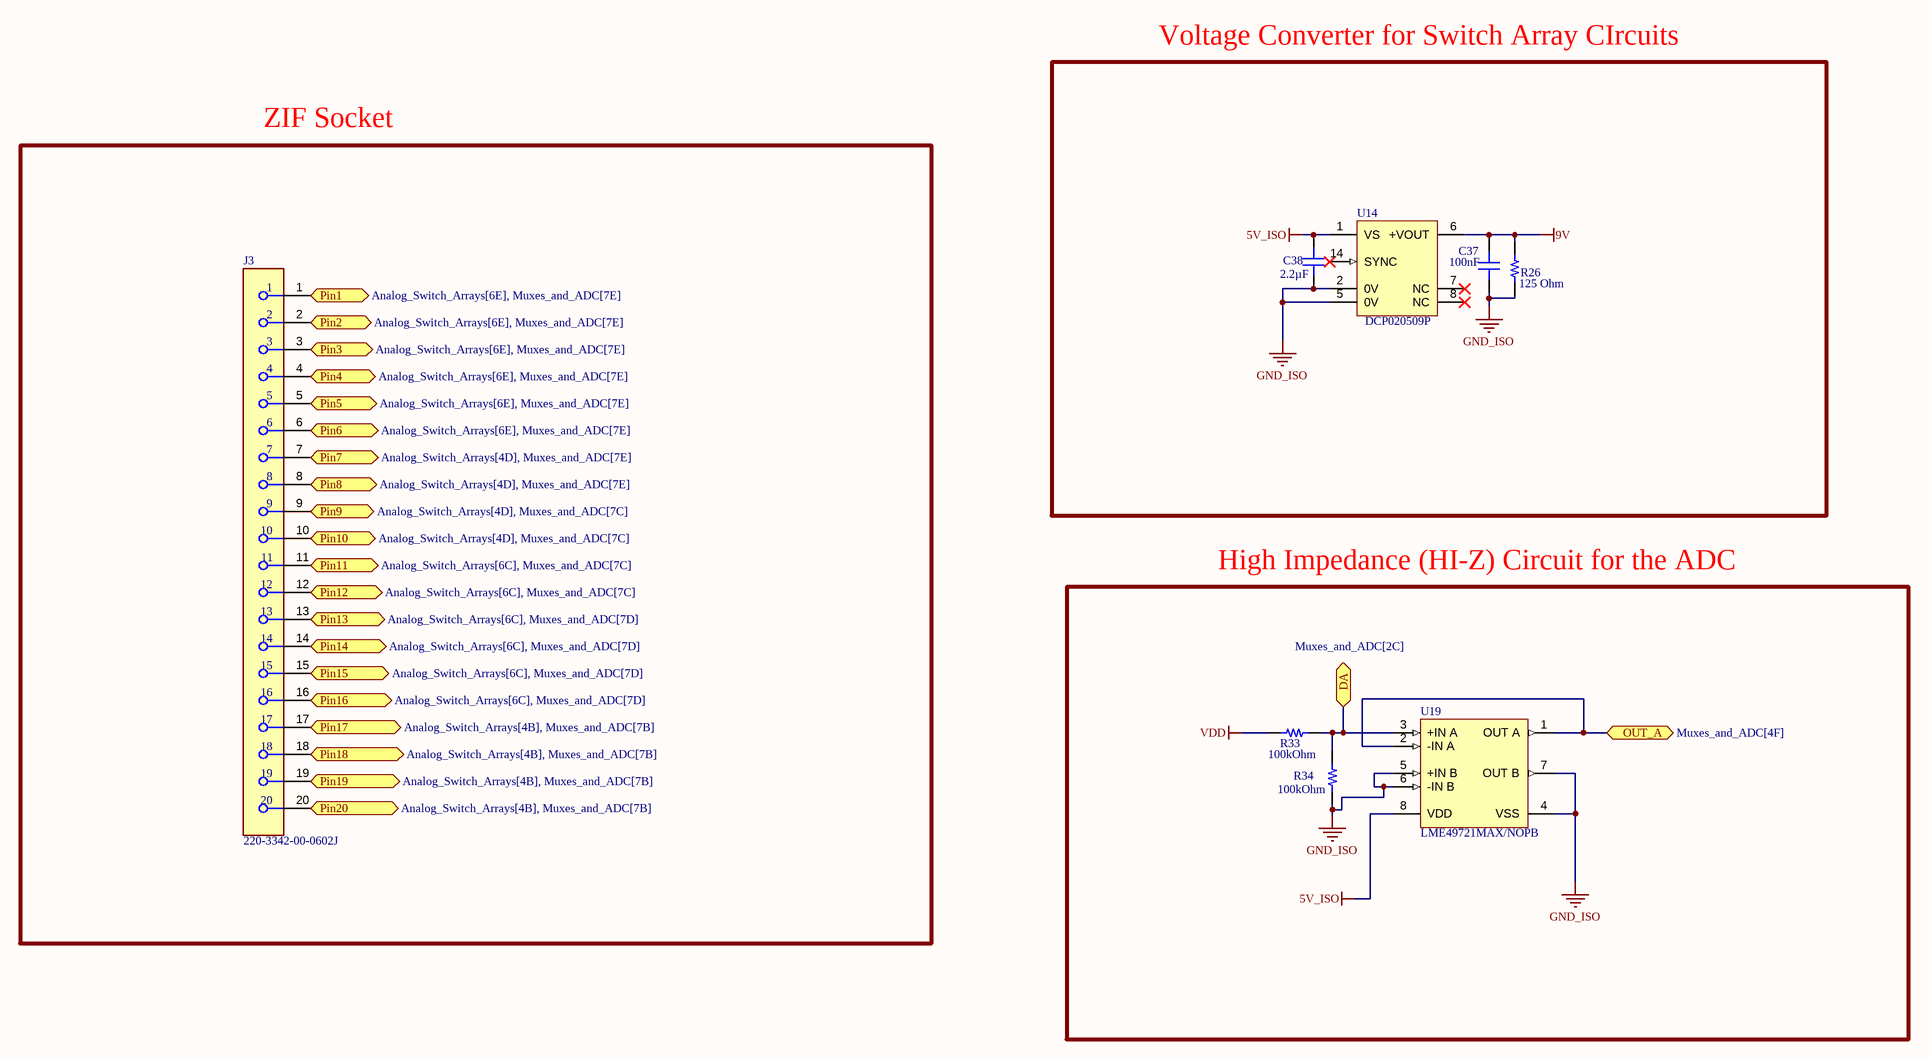
[diagram p3: ZIF_HIZ_and_Converter.SchDoc]

### Parts
C37  value 100nF  [CAP 1206_3216 - 0.8MM]  (hidden comment: C1206X104G4HAC7800)
C38  value 2.2µF  [CAP 1206_3216 - 0.8MM]  (hidden comment: CC1206ZRY5V8BB225)
J3  220-3342-00-0602J  [FP-220-3342-00-0602J-0]
R26  125 Ohm  [YAGEO RES 1206_3216]
R33  100kOhm  [RES 1206_3216]
R34  100kOhm  [RES 1206_3216]
U14  DCP020509P  [NVA0007A]
U19  LME49721MAX/NOPB  [D0008A_L]

### Blocks framed on the sheet
Voltage Converter for Switch Array CIrcuits: C37 C38 R26 U14
ZIF Socket: J3
High Impedance (HI-Z) Circuit for the ADC: R33 R34 U19

### Ports
DA (bidir, see Muxes_and_ADC[2C]), OUT_A (bidir, see Muxes_and_ADC[4F]), Pin1 (bidir, see Analog_Switch_Arrays[6E], Muxes_and_ADC[7E]), Pin2 (bidir, see Analog_Switch_Arrays[6E], Muxes_and_ADC[7E]), Pin3 (bidir, see Analog_Switch_Arrays[6E], Muxes_and_ADC[7E]), Pin4 (bidir, see Analog_Switch_Arrays[6E], Muxes_and_ADC[7E]), Pin5 (bidir, see Analog_Switch_Arrays[6E], Muxes_and_ADC[7E]), Pin6 (bidir, see Analog_Switch_Arrays[6E], Muxes_and_ADC[7E]), Pin7 (bidir, see Analog_Switch_Arrays[4D], Muxes_and_ADC[7E]), Pin8 (bidir, see Analog_Switch_Arrays[4D], Muxes_and_ADC[7E]), Pin9 (bidir, see Analog_Switch_Arrays[4D], Muxes_and_ADC[7C]), Pin10 (bidir, see Analog_Switch_Arrays[4D], Muxes_and_ADC[7C]), Pin11 (bidir, see Analog_Switch_Arrays[6C], Muxes_and_ADC[7C]), Pin12 (bidir, see Analog_Switch_Arrays[6C], Muxes_and_ADC[7C]), Pin13 (bidir, see Analog_Switch_Arrays[6C], Muxes_and_ADC[7D]), Pin14 (bidir, see Analog_Switch_Arrays[6C], Muxes_and_ADC[7D]), Pin15 (bidir, see Analog_Switch_Arrays[6C], Muxes_and_ADC[7D]), Pin16 (bidir, see Analog_Switch_Arrays[6C], Muxes_and_ADC[7D]), Pin17 (bidir, see Analog_Switch_Arrays[4B], Muxes_and_ADC[7B]), Pin18 (bidir, see Analog_Switch_Arrays[4B], Muxes_and_ADC[7B]), Pin19 (bidir, see Analog_Switch_Arrays[4B], Muxes_and_ADC[7B]), Pin20 (bidir, see Analog_Switch_Arrays[4B], Muxes_and_ADC[7B])

### Nets
5V_ISO: C38.2 U14.1(VS) U19.8(VDD)
9V: C37.2 R26.2 U14.6(+VOUT)
GND_ISO: C37.1 C38.1 R26.1 R34.1 U14.2(0V) U14.5(0V) U19.4(VSS) U19.5(+IN_B) U19.6(-IN_B) U19.7(OUT_B)
VDD: R33.1
NetJ3_1: J3.1 ; port Pin1
NetJ3_2: J3.2 ; port Pin2
NetJ3_3: J3.3 ; port Pin3
NetJ3_4: J3.4 ; port Pin4
NetJ3_5: J3.5 ; port Pin5
NetJ3_6: J3.6 ; port Pin6
NetJ3_7: J3.7 ; port Pin7
NetJ3_8: J3.8 ; port Pin8
NetJ3_9: J3.9 ; port Pin9
NetJ3_10: J3.10 ; port Pin10
NetJ3_11: J3.11 ; port Pin11
NetJ3_12: J3.12 ; port Pin12
NetJ3_13: J3.13 ; port Pin13
NetJ3_14: J3.14 ; port Pin14
NetJ3_15: J3.15 ; port Pin15
NetJ3_16: J3.16 ; port Pin16
NetJ3_17: J3.17 ; port Pin17
NetJ3_18: J3.18 ; port Pin18
NetJ3_19: J3.19 ; port Pin19
NetJ3_20: J3.20 ; port Pin20
NetR28_2: U19.1(OUT_A) U19.2(-IN_A) ; port OUT_A
NetR33_2: R33.2 R34.2 U19.3(+IN_A) ; port DA

Not connected (* = marked no-connect by the designer): U14 7(NC)* 8(NC)* 14(SYNC)*

### Notes on the sheet
- DWG. NO.
- REV.
- SHT.
- THIS DOCUMENT AND THE DATA DISCLOSED HEREIN OR HEREWITH IS THE PROPERTY OF ALTIUM LIMITED AND MAY BE FREELY DISTRIBUTED IN WHOLE. NO RIGHTS ARE RESERVED OR EXPRESS OR IMPLIED WARANTEE GIVEN.
- REVISION
- DESCRIPTION
- DATE
- APPROVED
- ENG:
- APPROVALS
- PROJECT
- DSN:
- CHK:
- REFERENCE DOCUMENTS
- PROJECT REVISION:
- TITLE
- DOCUMENT REVISION:
- DESIGN ITEM:
- BOM:
- FAB DWG:
- PCB DWG:
- ASSY DWG:
- SCALE:
- SIZE
- B
- CAGE CODE
- FILE NAME
- DWG NO.
- SHEET
- OF
- REV

### Library data of the parts
C37 = CMP-001-063573-1: CAP CER 1206 0.1F 16V ULTRA STAB; Part Number: C1206X104G4HAC7800
C38 = CMP-001-058176-1: CAP CER 2.2UF 25V Y5V 1206; Part Number: CC1206ZRY5V8BB225
J3 = CMP-05380-000001-1: CONN IC DIP SOCKET ZIF 20POS GLD; Manufacturer: 3M; Is Female: yes; Standoff Height: 0.38mm; Conn Orientation: Vertical; Number Of Contacts: 20; Conn Gender: Female; Socket Package: DIP20; Pitch: 2.54mm; Current Rating: 1A; Category: Conn; Temperature Range Low: -55°C; Package: 0; Device Class L3: unset; Temperature: -55°C to +125°C; Number Of Rows: 2; ComponentLink2Description: Datasheet; ComponentLink2URL: https://multimedia.3m.com/mws/media/494546O/3mtm-dip-sockets-100-2-54-mm-ts0365.pdf; Temperature Range High: +125°C; Digikey Description: CONN IC DIP SOCKET ZIF 20POS GLD; Mouser Description: IC & Component Sockets 0.100 DIP SOCKET 20 Contact Qty.; Manufacturer Part Number: 220-3342-00-0602J; Device Class L2: IC and Component Sockets; Octopart: https://octopart.com/220-3342-00-0602j-3m-108647; Device Class L1: Connectors; Contact Material: Gold,Nickel; Height: 24mm; Lead Free: Yes; RoHS: TRUE; Automotive: No
R26 = CMP-009-090155-1: RES SMD 125 OHM 0.1% 1/4W 1206; Part Number: RT1206BRD07125RL
R33 R34 = CMP-009-076876-1: RES 100K OHM 0.1% 1/4W 1206; Part Number: TNPW1206100KBEEA
U14 = CMP-0387-00789-2: Miniature, 2 W Isolated Unregulated DC-DC Converter, -40 to 85 degC, 7-pin DIP (NVA7), Pb-Free (RoHS); Manufacturer: Texas Instruments; SubFamily: 1 W & 2 W Miniature; Vout(Min)(V): 8.55; Iout(Max)(A): 0.222; Vout(Max)(V): 9.45; Vin(Min)(V): 4.5; Regulated Outputs(#): 1; Vin(Max)(V): 5.5; ComponentLink1URL: http://www.ti.com/; Eco-Plan: Pb-Free (RoHS); PackageDescription: 7-Pin Plastic In-Line, Body 6.61 x 19.18 mm; ComponentLink2URL: http://www.ti.com/general/docs/lit/getliterature.tsp?genericPartNumber=DCP020509&fileType=pdf; PackageReference: NVA0007A; DatasheetVersion: SBVS011K; Mounting Technology: Through Hole; ComponentLink4Description: URL Link1; ComponentLink3Description: Package Specification; PartNumber: DCP020509P; Code_JEDEC: MS-001-AA; PackageVersion: 4202489/B; ComponentLink4URL: Samples URL:http://www.ti.com/product/dcp020509#samples; ComponentLink1Description: Manufacturer URL; ComponentLink3URL: http://www.ti.com/lit/ml/mpdi058a/mpdi058a.pdf; ComponentLink2Description: Datasheet
U19 = CMP-0057-00384-3: High Performance, High Fidelity Rail-to-Rail Input/Output Audio Operational Amplifier, 8-pin Narrow SOIC, Pb-Free; Manufacturer: Texas Instruments; PowerWise: N; CompType: Audio IC; PackageTopMarking: NSZXTT*L49721*MA; ComponentLink1URL: http://www.ti.com/general/docs/lit/getliterature.tsp?genericPartNumber=LME49721&fileType=pdf; PackageReference: D0008A; RoHS: Y; ComponentLink1Description: Datasheet URL; Code_IPC: SOIC127P600-8; Code_JEDEC: MS-012-AA; PinCount: 8; PackageDescription: SOIC Narrow, 4.9 x 3.9 x 1.45mm, 8 Lead, 1.27mm Pitch

## Nets that join several sheets
5V_ISO: USB_to_UART (12 pins), Muxes_and_ADC (8 pins), Voltage_Reference_Circuit (5 pins), ZIF_HIZ_and_Converter (C38.2 U14.1 U19.8)
GND_ISO: USB_to_UART (21 pins), Muxes_and_ADC (31 pins), Voltage_Reference_Circuit (15 pins), ZIF_HIZ_and_Converter (10 pins)
VDD: USB_to_UART (6 pins), Muxes_and_ADC (13 pins), ZIF_HIZ_and_Converter (R33.1)
NetJ3_1: Muxes_and_ADC (U15.12), ZIF_HIZ_and_Converter (J3.1)
NetJ3_2: Muxes_and_ADC (U15.11), ZIF_HIZ_and_Converter (J3.2)
NetJ3_3: Muxes_and_ADC (U15.10), ZIF_HIZ_and_Converter (J3.3)
NetJ3_4: Muxes_and_ADC (U15.9), ZIF_HIZ_and_Converter (J3.4)
NetJ3_5: Muxes_and_ADC (U15.7), ZIF_HIZ_and_Converter (J3.5)
NetJ3_6: Muxes_and_ADC (U15.6), ZIF_HIZ_and_Converter (J3.6)
NetJ3_7: Muxes_and_ADC (U15.5), ZIF_HIZ_and_Converter (J3.7)
NetJ3_8: Muxes_and_ADC (U15.4), ZIF_HIZ_and_Converter (J3.8)
NetJ3_9: Muxes_and_ADC (U18.12), ZIF_HIZ_and_Converter (J3.9)
NetJ3_10: Muxes_and_ADC (U18.11), ZIF_HIZ_and_Converter (J3.10)
NetJ3_11: Muxes_and_ADC (U18.10), ZIF_HIZ_and_Converter (J3.11)
NetJ3_12: Muxes_and_ADC (U18.9), ZIF_HIZ_and_Converter (J3.12)
NetJ3_13: Muxes_and_ADC (U18.7), ZIF_HIZ_and_Converter (J3.13)
NetJ3_14: Muxes_and_ADC (U18.6), ZIF_HIZ_and_Converter (J3.14)
NetJ3_15: Muxes_and_ADC (U18.5), ZIF_HIZ_and_Converter (J3.15)
NetJ3_16: Muxes_and_ADC (U18.4), ZIF_HIZ_and_Converter (J3.16)
NetJ3_17: Muxes_and_ADC (U20.7), ZIF_HIZ_and_Converter (J3.17)
NetJ3_18: Muxes_and_ADC (U20.6), ZIF_HIZ_and_Converter (J3.18)
NetJ3_19: Muxes_and_ADC (U20.5), ZIF_HIZ_and_Converter (J3.19)
NetJ3_20: Muxes_and_ADC (U20.4), ZIF_HIZ_and_Converter (J3.20)
NetR28_2: Muxes_and_ADC (R28.2), ZIF_HIZ_and_Converter (U19.1 U19.2)
NetR33_2: Muxes_and_ADC (U16.8), ZIF_HIZ_and_Converter (R33.2 R34.2 U19.3)